# Altium project Thunder-Refix.PrjPcb
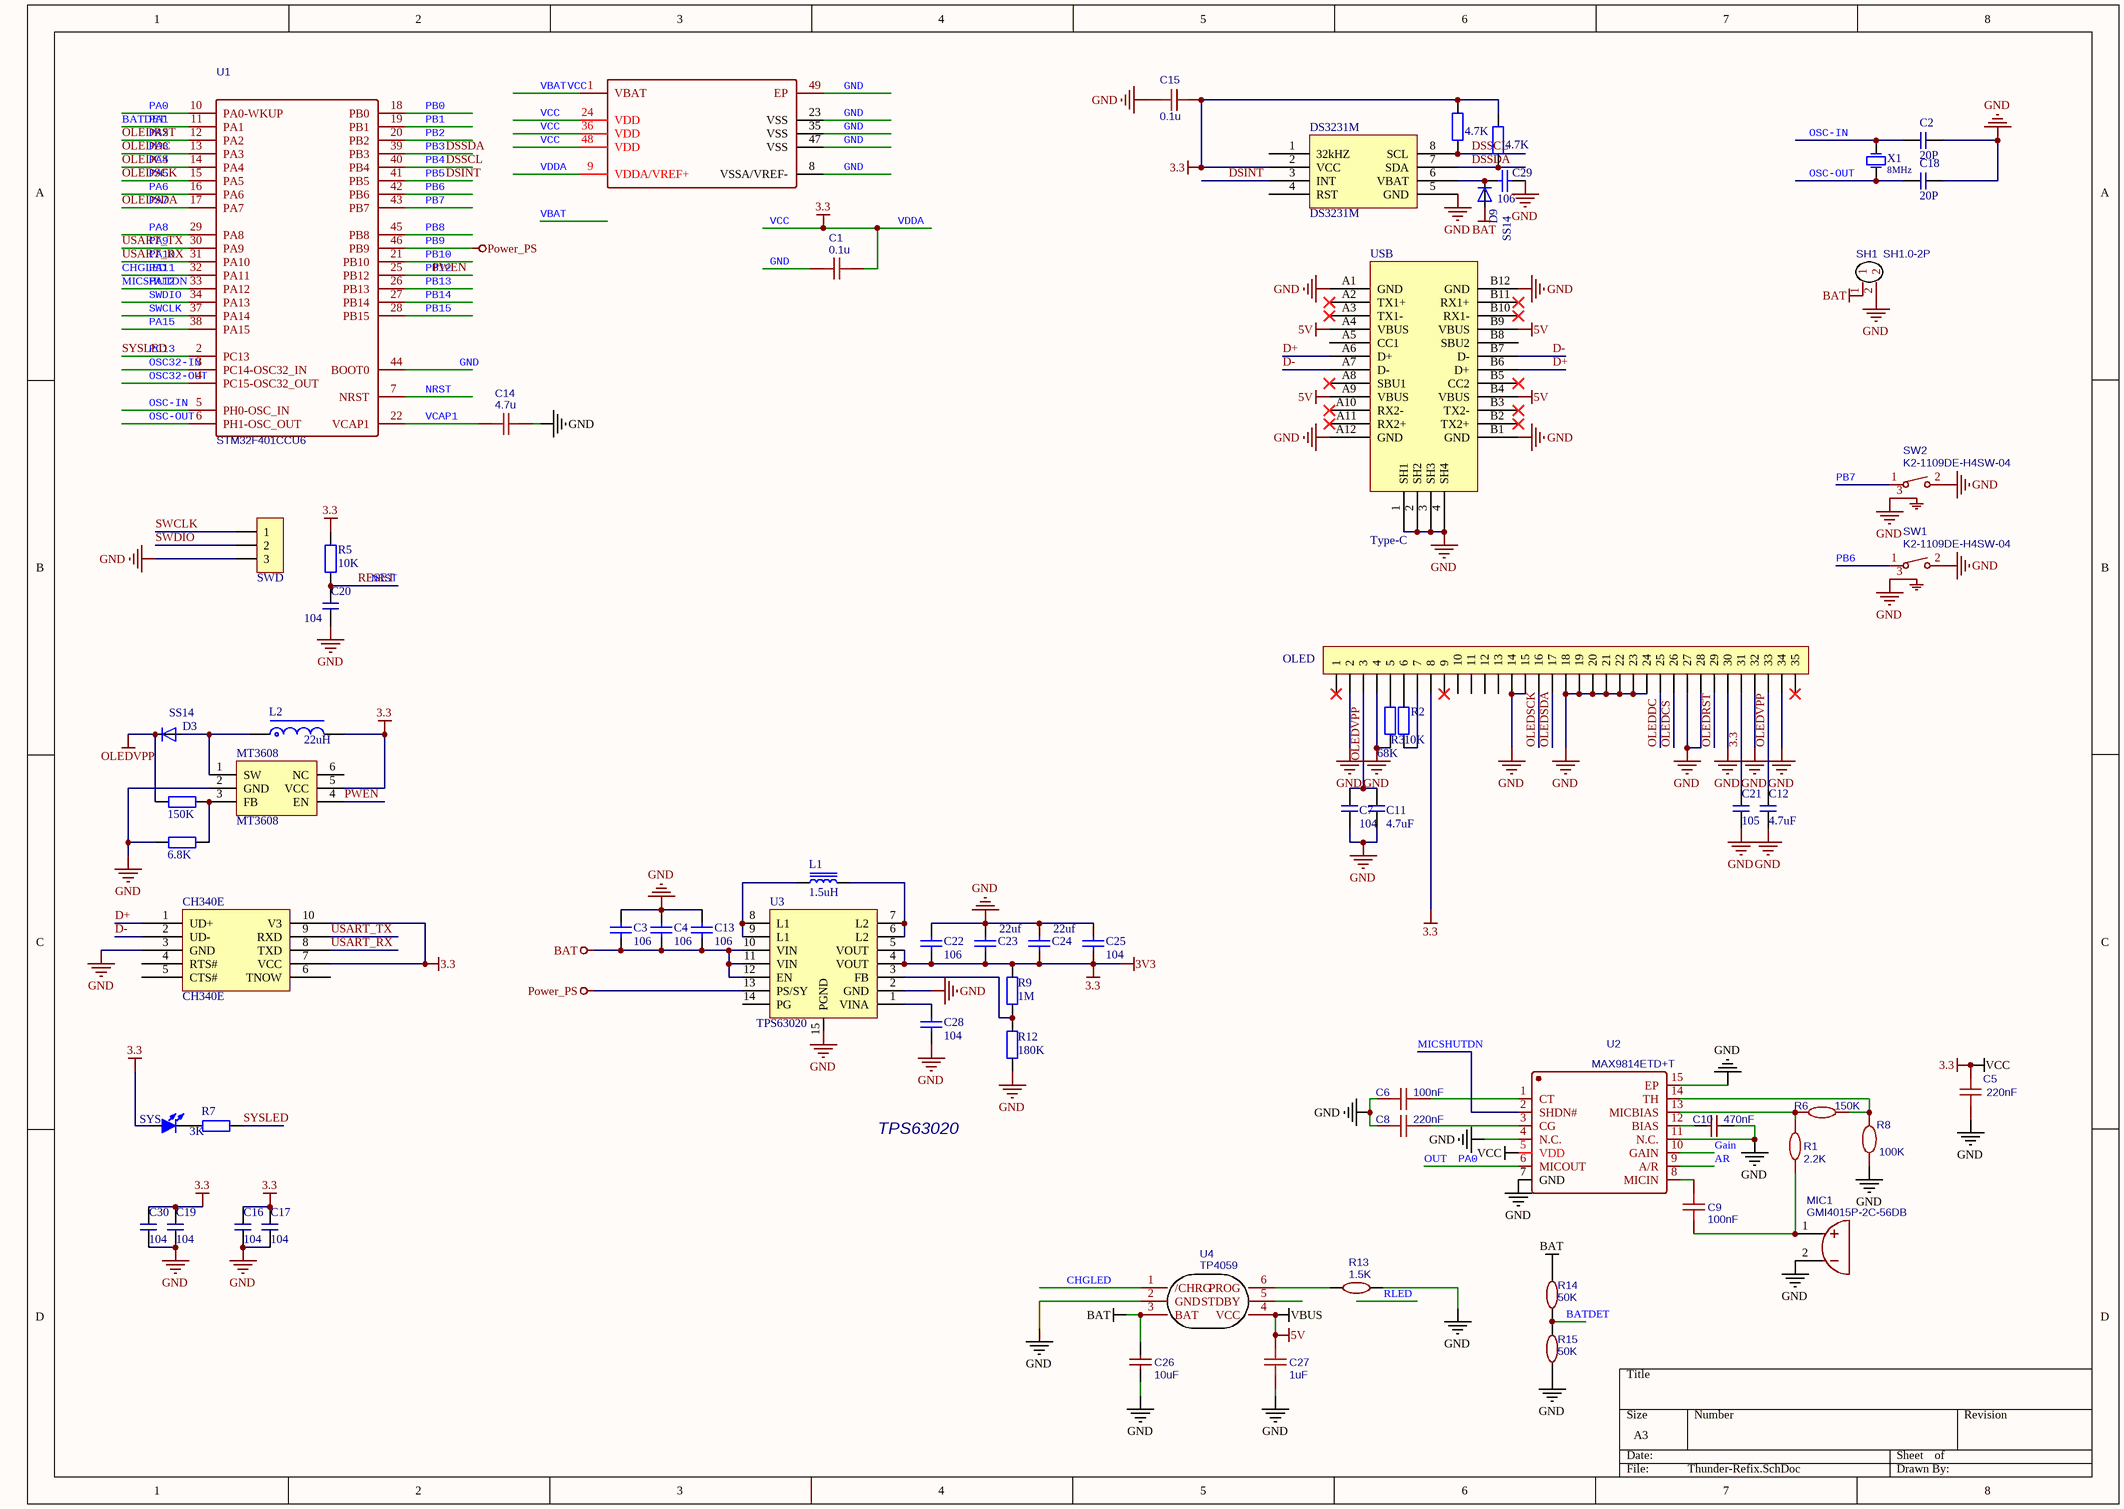
[diagram p0: Thunder-Refix.SchDoc]
1 sheet, 66 parts. Net scope: global (net labels, ports and power ports of the same name join across sheets).
Board file: Thunder-Refix.PcbDoc

## Sheet Thunder-Refix.SchDoc
size A3; DocumentNumber: 1; SheetNumber: 1; SheetTotal: 1

### Parts
C1  0.1u  [0603C]
C2  20P  [0603C]
C3  106  [0603c]
C4  106  [0603c]
C5  220nF  [0603c]
C6  100nF  [0603c]
C7  104  [0603C]
C8  220nF  [0603c]
C9  100nF  [0603c]
C10  470nF  [0603c]
C11  4.7uF  [0603C]
C12  4.7uF  [0603C]
C13  106  [0603c]
C14  4.7u  [0603C]
C15  0.1u  [0603C]
C16  104  [0603C]
C17  104  [0603C]
C18  20P  [0603C]
C19  104  [0603C]
C20  104  [0603C]
C21  105  [0603C]
C22  106  [0603c]
C23  22uf  [0603c]
C24  22uf  [0603c]
C25  104  [0603c]
C26  10uF  [0603c]
C27  1uF  [0603c]
C28  104  [0603c]
C29  106  [0603c]
C30  104  [0603C]
CH340E  CH340E  [MSOP10_L]
D3  SS14  [SOD323_1N4148WS]
D9  SS14  [SOD323_1N4148WS]
DS3231M  DS3231M  [SOP8]
L1  1.5uH  [IND-SMD_L3.0-W3.0_NR3010]
L2  22uH  [IND-SMD_L3.0-W3.0_NR3010]
MIC1  GMI4015P-2C-56DB  [MIC-TH_BD4.0-P2.00-D0.4-L-FD]
MT3608  MT3608  [SOT23-6N]
OLED  FPC1.0-35P  [1.69 OLED]  (value not drawn)
R1  2.2K  [0603r]
R2  10K  [0603R]
R3  68K  [0603R]
R5  10K  [0603R]
R6  150K  [0603r]
R7  3K  [0603R]
R8  100K  [0603r]
R9  1M  [0603r]
R10  4.7K  [0603R]
R11  4.7K  [0603R]
R12  180K  [0603r]
R13  1.5K  [0603r]
R14  50K  [0603r]
R15  50K  [0603r]
RB  150K  [0603R]
RS  6.8K  [0603R]
SH1  SH1.0-2P  [SH1.0-2P]
SW1  K2-1109DE-H4SW-04  [KEY-TH_K2-1109DE-CXXW-XX]
SW2  K2-1109DE-H4SW-04  [KEY-TH_K2-1109DE-CXXW-XX]
SWD  HDR-1X3  [ZH1.5-LI-3P]  (value not drawn)
SYS  粉色  [0603LED]  (value not drawn)
U1  STM32F401CCU6  [QFN48 7X7_N]
U2  MAX9814ETD+T  [TDFN-14_L3.0-W3.0-P0.40-BL-EP]
U3  TPS63020  [TPS63020]
U4  TP4059  [SOT23-6N]
USB  Type-C  [Type-C]
X1  value 8MHz  [OSC 5032-2P]  (hidden comment: 1.6.1.01.005.001)

### Nets
3.3: C1.1 C5.2 C15.1 C16.1 C17.1 C19.1 C21.1 C22.1 C23.1 C24.1 C25.1 C30.1 CH340E.7(VCC) CH340E.10(V3) DS3231M.2(VCC) L2.2 MT3608.5(VCC) OLED.8 OLED.31 R5.1 R9.1 R10.1 R11.1 SYS.1(A) U1.1(VBAT) U1.9(VDDA/VREF+) U1.24(VDD) U1.36(VDD) U1.48(VDD) U2.5(VDD) U3.4(VOUT) U3.5(VOUT)  [also labelled 3V3, VBAT, VCC, VDDA]
5V: C27.1 U4.4(VCC) USB.A4(VBUS) USB.A9(VBUS) USB.B4(VBUS) USB.B9(VBUS)  [also labelled VBUS]
BAT: C3.1 C4.1 C13.1 C26.2 D9.A R14.2 SH1.1 U3.10(VIN) U3.11(VIN) U3.12(EN) U4.3(BAT)
GND: C1.2 C2.1 C3.2 C4.2 C5.1 C6.1 C7.2 C8.1 C10.2 C11.2 C12.2 C13.2 C14.2 C15.2 C16.2 C17.2 C18.1 C19.2 C20.2 C21.2 C22.2 C23.2 C24.2 C25.2 C26.1 C27.2 C28.1 C29.1 C30.2 CH340E.3(GND) DS3231M.5(GND) MIC1.2 MT3608.2(GND) OLED.2 OLED.4 OLED.14 OLED.15 OLED.18 OLED.19 OLED.20 OLED.21 OLED.22 OLED.23 OLED.24 OLED.27 OLED.28 OLED.30 OLED.32 OLED.34 R3.1 R8.1 R12.2 R13.2 R15.1 RS.1 SH1.2 SW1.2 SW1.3(GND) SW2.2 SW2.3(GND) SWD.3 U1.8(VSSA/VREF-) U1.23(VSS) U1.35(VSS) U1.44(BOOT0) U1.47(VSS) U1.49(EP) U2.4(N.C.) U2.7(GND) U2.11(N.C.) U2.15(EP) U3.2(GND) U3.15(PGND) U4.2(GND) USB.1(SH1) USB.2(SH2) USB.3(SH3) USB.4(SH4) USB.A1(GND) USB.A12(GND) USB.B1(GND) USB.B12(GND)
OLEDVPP: C7.1 C11.1 C12.1 D3.C OLED.3 OLED.33 RB.1
PB9: U1.46(PB9) U3.13(PS/SY)  [also labelled Power_PS]
AR: U2.9(A/R)
BATDET: R14.1 R15.2 U1.11(PA1)  [also labelled PA1]
CHGLED: U1.32(PA11) U4.1(/CHRG)  [also labelled PA11]
D+: CH340E.1(UD+) USB.A6(D+) USB.B6(D+)
D-: CH340E.2(UD-) USB.A7(D-) USB.B7(D-)
DSINT: DS3231M.3(INT) U1.41(PB5)  [also labelled PB5]
DSSCL: DS3231M.8(SCL) R10.2 U1.40(PB4)  [also labelled PB4]
DSSDA: DS3231M.7(SDA) R11.2 U1.39(PB3)  [also labelled PB3]
Gain: U2.10(GAIN)
MICSHUTDN: U1.33(PA12) U2.2(SHDN#)  [also labelled PA12]
NRST: C20.1 R5.2 U1.7(NRST)  [also labelled RESET]
OLEDCS: OLED.26 U1.14(PA4)  [also labelled PA4]
OLEDDC: OLED.25 U1.13(PA3)  [also labelled PA3]
OLEDRST: OLED.29 U1.12(PA2)  [also labelled PA2]
OLEDSCK: OLED.16 U1.15(PA5)  [also labelled PA5]
OLEDSDA: OLED.17 U1.17(PA7)  [also labelled PA7]
OSC32-IN: U1.3(PC14-OSC32_IN)
OSC32-OUT: U1.4(PC15-OSC32_OUT)
OSC-IN: C2.2 U1.5(PH0-OSC_IN) X1.1(OSC1)
OSC-OUT: C18.2 U1.6(PH1-OSC_OUT) X1.2(OSC2)
OUT: U1.10(PA0-WKUP) U2.6(MICOUT)  [also labelled PA0]
PA6: U1.16(PA6)
PA8: U1.29(PA8)
PA9: CH340E.9(RXD) U1.30(PA9)  [also labelled USART_TX]
PA10: CH340E.8(TXD) U1.31(PA10)  [also labelled USART_RX]
PA15: U1.38(PA15)
PB0: U1.18(PB0)
PB1: U1.19(PB1)
PB2: U1.20(PB2)
PB6: SW1.1 U1.42(PB6)
PB7: SW2.1 U1.43(PB7)
PB8: U1.45(PB8)
PB10: U1.21(PB10)
PB12: MT3608.4(EN) U1.25(PB12)  [also labelled PWEN]
PB13: U1.26(PB13)
PB14: U1.27(PB14)
PB15: U1.28(PB15)
PC13: R7.1 U1.2(PC13)  [also labelled SYSLED]
SWCLK: SWD.1 U1.37(PA14)
SWDIO: SWD.2 U1.34(PA13)
VCAP1: C14.1 U1.22(VCAP1)
NetC6_2: C6.2 U2.1(CT)
NetC8_2: C8.2 U2.3(CG)
NetC9_1: C9.1 U2.8(MICIN)
NetC9_2: C9.2 MIC1.1 R1.1
NetC10_1: C10.1 U2.12(BIAS)
NetC28_2: C28.2 U3.1(VINA)
NetC29_2: C29.2 D9.C DS3231M.6(VBAT)
NetD3_A: D3.A L2.1 MT3608.1(SW)
NetL1_1: L1.1 U3.8(L1) U3.9(L1)
NetL1_2: L1.2 U3.6(L2) U3.7(L2)
NetMT3608_3: MT3608.3(FB) RB.2 RS.2
NetOLED_5: OLED.5 R3.2
NetOLED_6: OLED.6 R2.2
NetOLED_7: OLED.7 R2.1
NetR1_2: R1.2 R6.1 U2.13(MICBIAS)
NetR6_2: R6.2 R8.2 U2.14(TH)
NetR7_2: R7.2 SYS.2(K)
NetR9_2: R9.2 R12.1 U3.3(FB)
NetR13_1: R13.1 U4.6(PROG)

Not connected (* = marked no-connect by the designer): CH340E 4(RTS#) 5(CTS#) 6(TNOW); DS3231M 1(32kHZ) 4(RST); MT3608 6(NC); OLED 1* 9* 10 11 12 13 35*; U3 14(PG); U4 5(STDBY); USB A2(TX1+)* A3(TX1-)* A5(CC1) A8(SBU1)* A10(RX2-)* A11(RX2+)* B2(TX2+)* B3(TX2-)* B5(CC2)* B8(SBU2) B10(RX1-)* B11(RX1+)*

### Notes on the sheet
- TPS63020

### Library data of the parts
C1 C15 = 0.1u: nameAlias: Value(F); Contributor: LCEDA_Lib; spicePre: C; spiceSymbolName: C_0402_US
C2 C7 C11 C12 C16-C21 C30 = 电容
C3 C4 C13 C22-C25 C28 C29 = cap: U: 50V; 参数: Cap,0805,X7R,104K,50V,125C,±10%
  C3 C4 C13 C22 C29: C: 106
  C23 C24: C: 22uf
  C25 C28: C: 104
C5 C8 = 220nF: BOM_Manufacturer: Murata Electronics; BOM_Manufacturer Part: GCJ21BR71H224KA01L; nameAlias: Capacitance; Contributor: LCSC; BOM_Supplier: LCSC; BOM_Supplier Part: C354366; spicePre: C; spiceSymbolName: GCJ21BR71H224KA01L
C6 C9 = 100nF: BOM_Manufacturer: AVX; BOM_Manufacturer Part: FS055C104K4Z2A; nameAlias: Capacitance; Contributor: LCSC; BOM_Supplier: LCSC; BOM_Supplier Part: C444732; spicePre: C; spiceSymbolName: FS055C104K4Z2A
C10 = 470nF: BOM_Manufacturer Part: CL21B474KBFNNNE; BOM_Manufacturer: SAMSUNG; nameAlias: Capacitance; SMT Type: Basic; BOM_Supplier: LCSC; BOM_LCSC Assembly: Yes; BOM_Supplier Part: C13967; spicePre: C; spiceSymbolName: CL21B474KBFNNNE
C14 = 4.7u: nameAlias: Value(F); Contributor: LCEDA_Lib; spicePre: C; spiceSymbolName: C_0402_US
C26 = 10uF: BOM_Manufacturer: Murata Electronics; BOM_Manufacturer Part: GRM21BB31C106KE15L; nameAlias: Capacitance; Contributor: LCSC; BOM_Supplier: LCSC; BOM_Supplier Part: C162317; spicePre: C; spiceSymbolName: GRM21BB31C106KE15L
C27 = 1uF: BOM_Manufacturer: Taiyo Yuden; BOM_Manufacturer Part: UMK212BJ105KG-T; nameAlias: Capacitance; Contributor: LCSC; BOM_Supplier: LCSC; BOM_Supplier Part: C319195; spicePre: C; spiceSymbolName: UMK212BJ105KG-T
D3 D9 = 1N4148WS: Diode Switching 75V 0.3A 2-Pin SOD-323 T/R; MF: ON Semiconductor; SnapEDA_Link: https://www.snapeda.com/parts/1N4148WS/ON%20Semiconductor/view-part/?ref=snap; Price: None; Availability: Unavailable; MP: 1N4148WS; Package: S-0 Good-Ark; Value: *
L1 = Inductor Iron 2: _Current: 10A; _Accuracy: 20%; _Footprint: 1040; _Name: IND; _Specification: IND,1040,1.5uH,10A,20%; _Comma: ,; _Value: 1.5uH
L2 = L-CDRH: 功率屏蔽电感; 版权归属: 源创客; BOM名称: 功率屏蔽电感; 学习资源: www.ooocke.com
MIC1 = GMI4015P-2C-56DB: BOM_Manufacturer: INGHAi; Contributor: LCSC; BOM_Supplier: LCSC; BOM_Supplier Part: C233299; BOM_Manufacturer Part: GMI4015P-2C-56db; spicePre: M; spiceSymbolName: GMI4015P-2C-56DB
MT3608 = SX1308: 可调升压芯片; 版权归属: 源创客; BOM名称: 可调升压芯片; 学习资源: www.ooocke.com
OLED = FPC-35P: FPC连接器; 版权归属: 源创客; BOM名称: FPC连接器; 学习资源: www.ooocke.com
R1 = 2.2K: BOM_Manufacturer: Tyohm; BOM_Manufacturer Part: RMC08052.2K1%N; nameAlias: Resistance (Ohms); Contributor: LCSC; BOM_Supplier: LCSC; BOM_Supplier Part: C325769; spicePre: R; spiceSymbolName: RMC08052.2K1%N
R2 R3 R5 R7 R10 R11 RB RS = R: 贴片电阻; 版权归属: 源创客; BOM名称: 贴片电阻; 学习资源: www.ooocke.com
R6 = 150K: BOM_Manufacturer: Tyohm; BOM_Manufacturer Part: RMC0805150K1%N; nameAlias: Resistance (Ohms); Contributor: LCSC; BOM_Supplier: LCSC; BOM_Supplier Part: C325765; spicePre: R; spiceSymbolName: RMC0805150K1%N
R8 = 100K: BOM_Manufacturer: Stackpole Elec; BOM_Manufacturer Part: RTAN0805BKE100K; nameAlias: Resistance (Ohms); Contributor: LCSC; SMT Type: Extend; BOM_Supplier: LCSC; BOM_Supplier Part: C346756; BOM_LCSC Assembly: Yes; spicePre: R; spiceSymbolName: RTAN0805BKE100K
R9 R12 = Res: P: 1/8W; 参数: Res,0805,0R,±1%,1/8W,100ppm,155C
  R9: R: 1M
  R12: R: 180K
R13-R15 = 1.5K: BOM_Manufacturer: YAGEO; BOM_Manufacturer Part: RC0603FR-071K5L; nameAlias: Resistance (Ohms); BOM_Supplier: LCSC; BOM_Supplier Part: C114668; spicePre: R; spiceSymbolName: RC0603FR-071K5L
SH1 = SH1.0-2P: Contributor: perry2867; spicePre: J; spiceSymbolName: SH1.0-2P
SW1 SW2 = K2-1109DE-H4SW-04: BOM_Manufacturer: 韩国韩荣; Contributor: LCSC; BOM_Supplier: LCSC; BOM_Supplier Part: C961730; BOM_Manufacturer Part: K2-1109DE-H4SW-04; spicePre: S; spiceSymbolName: K2-1109DE-H4SW-04
SWD = Header 3: 3P接插件; 版权归属: 源创客; BOM名称: 3P接插件; 学习资源: www.ooocke.com
SYS = LED-F234: 方形LED; 版权归属: 源创客; BOM名称: 方形LED; 学习资源: www.ooocke.com
U1 = STM32F401CCU6: BOM_Manufacturer: ST; subpart_no: 1; tags: STM32; BOM_Supplier Part: C79861; BOM_Supplier: LCSC; BOM_Manufacturer Part: STM32F401CCU6; spicePre: U; spiceSymbolName: STM32F401CCU6
U2 = MAX9814ETD+T: BOM_Manufacturer: MAXIM; BOM_Supplier: LCSC; BOM_Manufacturer Part: MAX9814ETD+T; image: //image.lceda.cn/szlcsc/C41714.jpg; BOM_Supplier Part: C41714; spicePre: U; spiceSymbolName: MAX9814ETD+T
U4 = TP4059: BOM_Manufacturer: TOPPOWER; SMT Type: Extend; BOM_Supplier: LCSC; BOM_Manufacturer Part: TP4059; BOM_Supplier Part: C80364; BOM_LCSC Assembly: Yes; spicePre: U; spiceSymbolName: TP4059
X1 = 1.6.1.01.005.001: XTAL,8MHz,±20PPM,12.6*4.5; K3 No.: 1.6.1.01.005.001; GENERAL: *